# EAGLE design RF1 (EAGLE 6.4)
www.komby.com/RF1
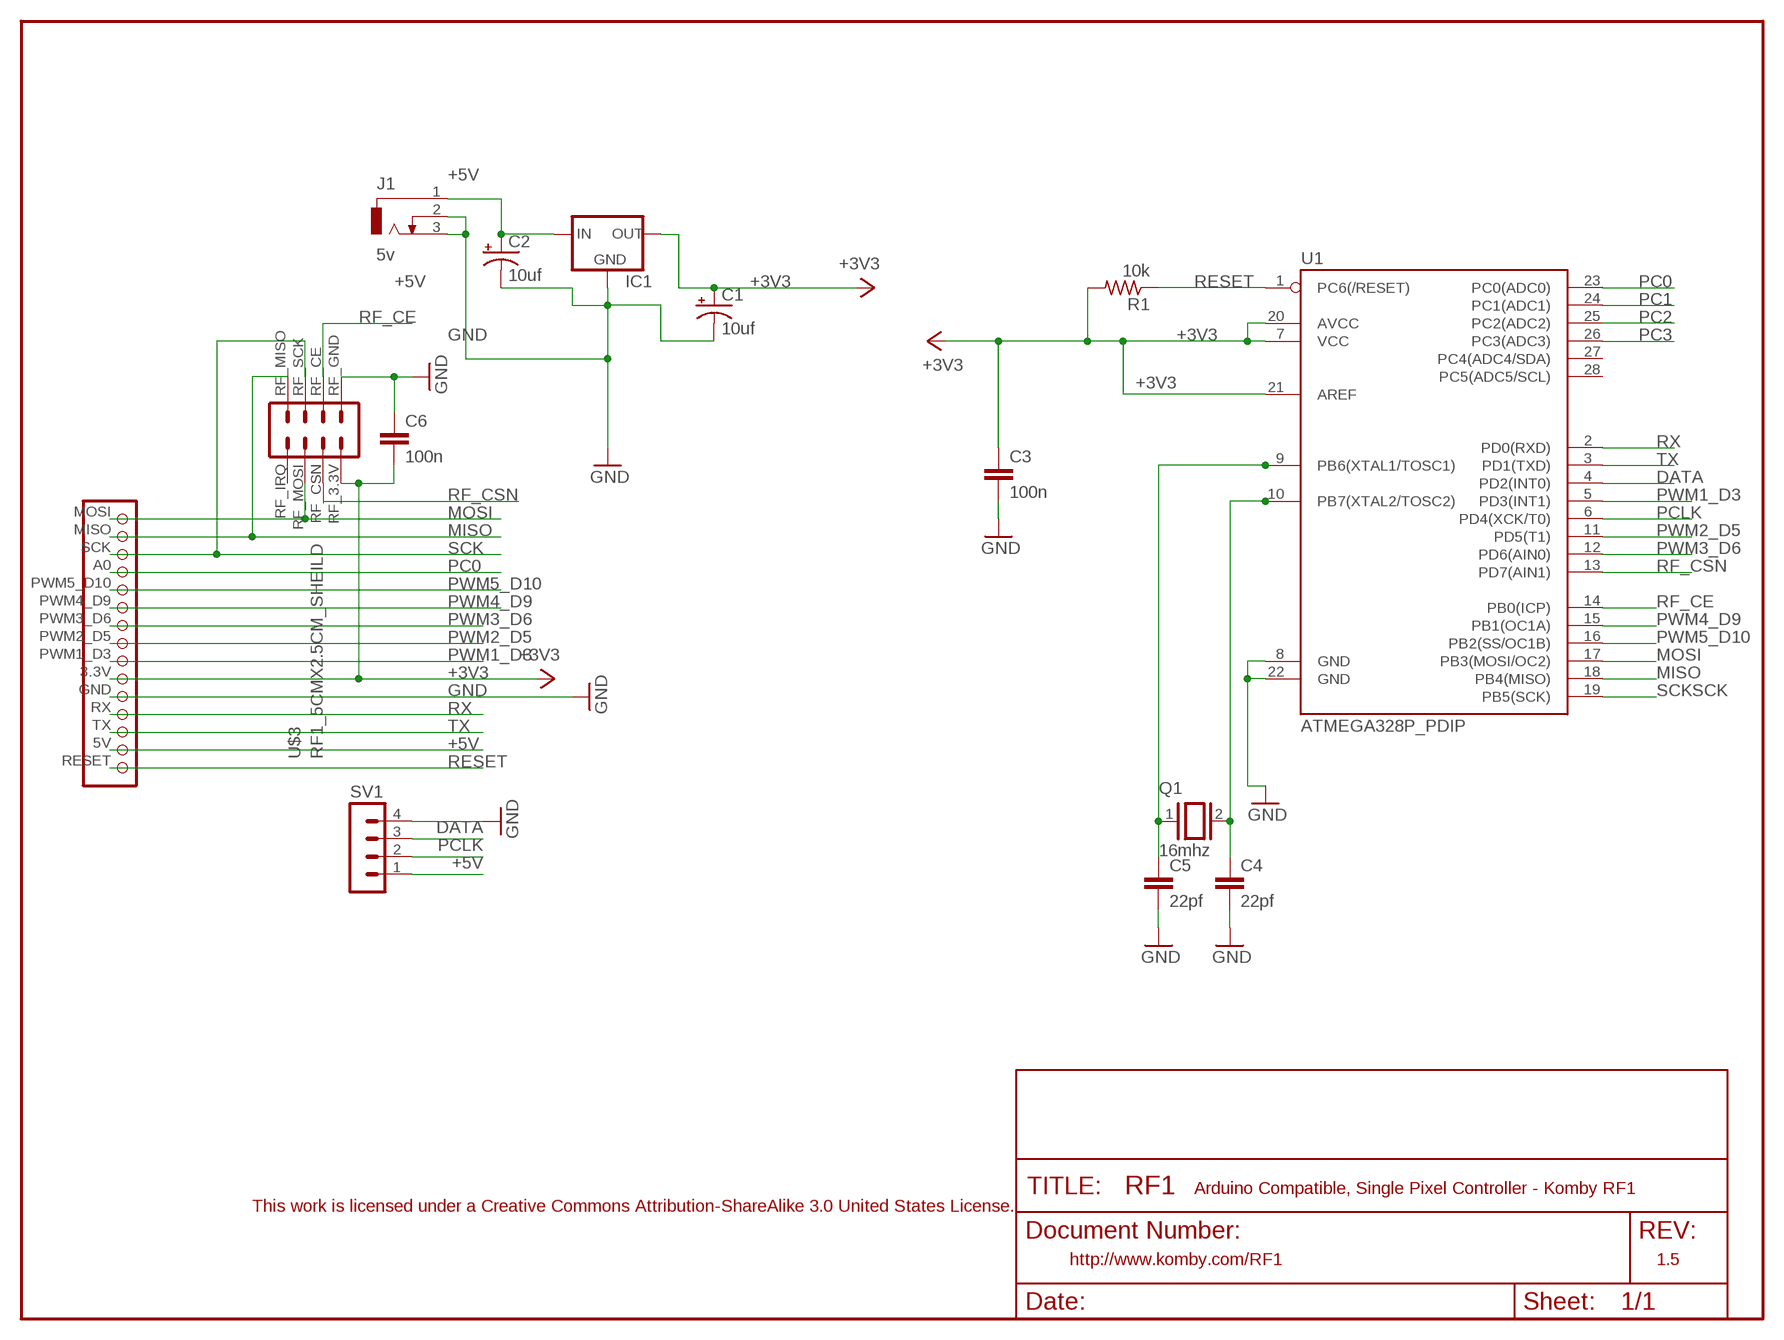
[diagram p0: schematic, sheet 1]

## Parts
C1  10uf  CPOL-USE1.8-4  [E1,8-4]
C2  10uf  CPOL-USE1.8-4  [E1,8-4]
C3  100n  C-EU025-024X044  [C025-024X044]
C4  22pf  C-EU025-024X044  [C025-024X044]
C5  22pf  C-EU025-024X044  [C025-024X044]
C6  100n  C-EU025-024X044  [C025-024X044]
IC1  MCP1700TRI  [TO92]
J1  5v  DCJ0303  [DCJ0303]
Q1  16mhz  XTAL/S  [QS]
R1  10k  R-US_0207/7  [0207/7]
SV1  MA04-1  [MA04-1]
U1  ATMEGA328P_PDIP  [DIL28-3]
U$3  RF1_5CMX2.5CM_SHEILD  [KOMBY_RF1_SHEILD_5X2.5]

## Nets
+3V3 [vcc]: C1.+ C3.1 C6.2 IC1.3(OUT) R1.2 U1.7(VCC) U1.20(AVCC) U1.21(AREF) U$3.3.3V U$3.RF_3.3V
+5V: C2.+ IC1.2(IN) J1.1 SV1.1 U$3.5V
DATA: SV1.3 U1.4(PD2(INT0))
GND [vcc]: C1.- C2.- C3.2 C4.2 C5.2 C6.1 IC1.1(GND) J1.2 J1.3 SV1.4 U1.8(GND) U1.22(GND) U$3.GND U$3.RF_GND(RFGND_1)
MISO: U1.18(PB4(MISO)) U$3.MISO U$3.RF_MISO
MOSI: U1.17(PB3(MOSI/OC2)) U$3.MOSI U$3.RF_MOSI
N$5: C4.1 Q1.2 U1.10(PB7(XTAL2/TOSC2))
N$6: C5.1 Q1.1 U1.9(PB6(XTAL1/TOSC1))
PC0: U1.23(PC0(ADC0)) U$3.A0(PC0)
PC1: U1.24(PC1(ADC1))
PC2: U1.25(PC2(ADC2))
PC3: U1.26(PC3(ADC3))
PCLK: SV1.2 U1.6(PD4(XCK/T0))
PWM1_D3: U1.5(PD3(INT1)) U$3.PWM1_D3(PWM1)
PWM2_D5: U1.11(PD5(T1)) U$3.PWM2_D5(PWM2)
PWM3_D6: U1.12(PD6(AIN0)) U$3.PWM3_D6(PWM3)
PWM4_D9: U1.15(PB1(OC1A)) U$3.PWM4_D9(PWM4)
PWM5_D10: U1.16(PB2(SS/OC1B)) U$3.PWM5_D10(PWM5)
RESET: R1.1 U1.1(PC6(/RESET)) U$3.RESET
RF_CE: U1.14(PB0(ICP)) U$3.RF_CE
RF_CSN: U1.13(PD7(AIN1)) U$3.RF_CSN
RX: U1.2(PD0(RXD)) U$3.RX
SCK: U1.19(PB5(SCK)) U$3.RF_SCK U$3.SCK
TX: U1.3(PD1(TXD)) U$3.TX
Unconnected: U1.27(PC4(ADC4/SDA)) U1.28(PC5(ADC5/SCL)) U$3.RF_IRQ

## Notes on the sheet
- Arduino Compatible, Single Pixel Controller - Komby RF1
- This work is licensed under a Creative Commons Attribution-ShareAlike 3.0 United States License.
- http://www.komby.com/RF1 | 1.5

## Library data of the parts
C1 C2 = adafruit:CPOL-US: POLARIZED CAPACITOR, American symbol
C3-C6 = resistor:C-EU: CAPACITOR, European symbol
IC1 = adafruit:MCP1700: VOLTAGE REGULATOR
J1 = con-jack_komby:DCJ0303: DC POWER JACK Source: DCJ0303.pdf; OC_FARNELL: unknown; OC_NEWARK: unknown
Q1 = special:XTAL/S: CRYSTAL
R1 = adafruit:R-US_: RESISTOR, American symbol
SV1 = con-lstb:MA04-1: PIN HEADER; OC_FARNELL: unknown; OC_NEWARK: unknown
U1 = SparkFun-DigitalIC:ATMEGA328P_PDIP: uC used in the Arduino 32kb flash, 1k EEPROM, 2k SRAM This is the through-hole version of this chip.
U$3 = komby1:RF1_5CMX2.5CM_SHEILD

## Net classes
0 default: width 0.203 mm
1 vcc: width 0.305 mm
2 gnd: width 0.254 mm

## Board
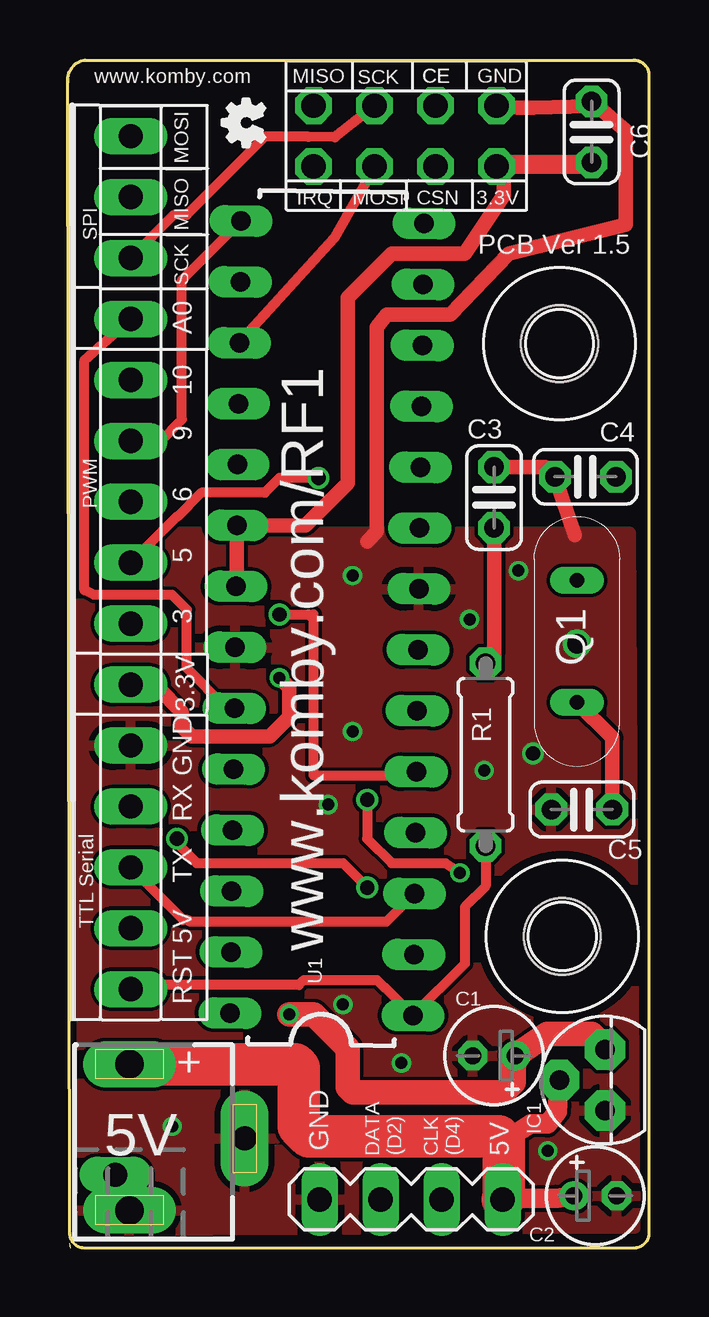
[diagram p1: board, top side]
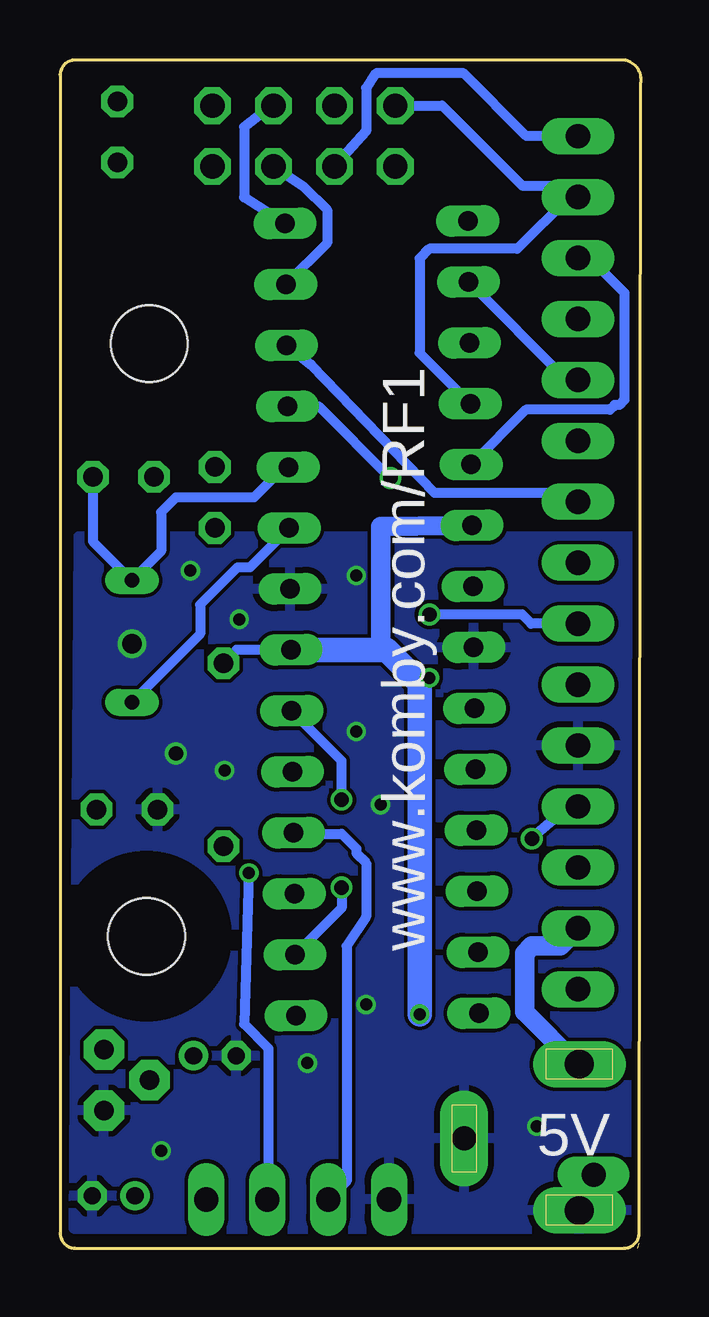
[diagram p2: board, bottom side, seen from below]

Size 24.21 x 49.53 mm. Coordinates in mm from the lower left corner, seen from the top.
Outline: 0.13,0 0.08,0.2
Copper layers (1*16): Top 0.035mm / dielectric 1.5mm / Bottom 0.035mm
Design rules "Fusion_eagle_rule_v1.1": minimum track width 6mil, minimum drill 12mil, track to track 6mil, track to pad 6mil, pad to pad 6mil, via to via 6mil, smd to smd 0mil, copper to edge 10mil, drill to drill 10mil, minimum pad ring 10mil, minimum via ring 6mil, stop-mask expansion 2mil, vias tented up to drill 100mil, thermal gap 10mil

### Footprints (pad centres in the part's own frame; a part is rotated, then mirrored left to right if it is on the bottom)
E1,8-4 = drill 0.711 pad 1.168: + -0.889,0 | drill 0.711 pad 1.168 octagon: - 0.889,0
C025-024X044 = drill 0.813 octagon: 1 -1.27,0; 2 1.27,0
TO92 = drill 0.813 pad 1.676 octagon: 1 -1.27,0; 2 0,1.905; 3 1.27,0
DCJ0303 = drill 1.2 pad 1.93 long: 1 0,3.1; 3 0,-3 | drill 1 pad 2 long: 2 4.8,0 | drill 1 long: P$1 -0.589,-1.501
QS = drill 0.61 long: 1 -2.54,0; 2 2.54,0
0207/7 = drill 0.813 octagon: 1 -3.81,0; 2 3.81,0
MA04-1 = drill 1.016 long: 1 -3.81,0; 2 -1.27,0; 3 1.27,0; 4 3.81,0
DIL28-3 = drill 0.813 long: 1 -16.51,-3.81; 2 -13.97,-3.81; 3 -11.43,-3.81; 4 -8.89,-3.81; 5 -6.35,-3.81; 6 -3.81,-3.81; 7 -1.27,-3.81; 8 1.27,-3.81; 9 3.81,-3.81; 10 6.35,-3.81; 11 8.89,-3.81; 12 11.43,-3.81; 13 13.97,-3.81; 14 16.51,-3.81; 15 16.51,3.81; 16 13.97,3.81; 17 11.43,3.81; 18 8.89,3.81; 19 6.35,3.81; 20 3.81,3.81; 21 1.27,3.81; 22 -1.27,3.81; 23 -3.81,3.81; 24 -6.35,3.81; 25 -8.89,3.81; 26 -11.43,3.81; 27 -13.97,3.81; 28 -16.51,3.81
KOMBY_RF1_SHEILD_5X2.5 = drill 1.016 long: 3.3V 2.54,23.495; 5V 2.54,13.335; A0 2.54,38.735; GND 2.54,20.955; MISO 2.54,43.815; MOSI 2.54,46.355; PWM1_D3 2.54,26.035; PWM2_D5 2.54,28.575; PWM3_D6 2.54,31.115; PWM4_D9 2.54,33.655; PWM5_D10 2.54,36.195; RESET 2.54,10.795; RX 2.54,18.415; SCK 2.54,41.275; TX 2.54,15.875 | drill 1.016 octagon: RF_3.3V 17.78,45.085; RF_CE 15.24,47.625; RF_CSN 15.24,45.085; RF_GND 17.78,47.625; RF_IRQ 10.16,45.085; RF_MISO 10.16,47.625; RF_MOSI 12.7,45.085; RF_SCK 12.7,47.625 | hole 3.2: 20.406,37.703; 20.523,13.005

### Placement (x,y rotation side)
C1  17.76,8.03 180 top
C2  21.98,2.18 0 top
C3  17.76,31.29 90 top
C4  21.57,32.16 180 top
C5  21.42,18.29 180 top
C6  21.83,46.53 270 top
IC1  22.38,7.01 90 top
J1  2.57,4.57 0 top
Q1  21.22,25.3 90 top
R1  17.41,20.57 90 top
SV1  14.31,2.03 180 top
U1  10.8,26.26 89.2 top
U$1  [OSHW_FILLX70_NOTEXT]  8.21,45.92 90 top
U$3  0.08,0 0 top

### Tracks (layer width: path | path; a pad name or v marks a point on that pad's centre or on a via)
+3V3  (via drill 0.5)
  Top 0.61: v8.82,23.77 9.23,23.37 9.23,22.15 8.41,21.34 5.16,21.34 4.76,21.74 4.76,22.35 3.74,23.37 2.75,23.37 U$3.3.3V | C3.1 17.76,24.74 R1.2 | U1.21 7.04,27.62 U1.20 9.89,30.13 11.66,31.9 11.66,39.62 13.49,41.45 16.54,41.45 18.17,43.89 18.17,45.26 C6.2 21.55,45.09 U$3.RF_3.3V
  Top 1.016: IC1.3 22.28,8.48 21.82,8.94 19.97,8.94 C1.+ 18.57,7.54 18.57,6.91 18.17,6.5 11.87,6.5 11.66,6.71 11.66,8.33 10.24,9.75 v9.23,9.75
  Bottom 0.406: U1.7 16.85,24.94 R1.2
  Bottom 0.61: 9.02,21.34 9.23,21.54 | v8.82,23.77 9.02,23.77 9.23,23.57
  Bottom 0.813: U1.20 7.75,30.13 10.85,30.07 10.85,24.94
  Bottom 1.016: U1.7 10.85,24.94 10.6,24.94 9.23,23.57 9.23,21.54 v9.23,9.75
+5V
  Top 0.813: IC1.2 20.4,5.69 20,5.18 19.28,5.18 18.17,4.47 | 18.17,2.08 20.38,2.08 C2.+
  Top 1.778: J1.1 9.48,7.67 9.63,7.52 9.63,5.08 10.04,4.67 17.96,4.67 18.17,4.47 18.17,2.08 SV1.1
  Bottom 0.813: J1.1 2.67,7.67 4.86,9.86 4.86,12.29 4.55,12.6 3.36,12.6 U$3.5V
DATA
  Bottom 0.406: U1.4 14.44,17.27 12.48,17.27 11.87,16.66 11.87,16.46 11.46,16.05 11.46,13.82 12.27,12.6 12.27,2.79 SV1.3 13.09,1.98
GND  (via drill 0.5, 0.6, 0.8 pad 1.02)
  Top 0.61: 21.11,29.72 C4.2 19.89,32.56 C3.2 | 12.48,29.46 12.88,29.87 12.88,38.41 13.29,38.91 15.93,38.91 18.37,41.45 23.25,42.67 23.25,46.58 C6.1 21.77,47.6 19.39,47.55 18.75,47.55 U$3.RF_GND
  other vias: 10.85,18.49 16.75,26.21 13.9,7.72 11.46,10.16 18.78,28.24 19.39,20.62 11.87,21.54 17.35,19.91 4.35,5.08 20,4.06 11.87,28.04 21.22,25.2
  pour Bottom: 23.65,0.81 1.15,0.81 arc-90 0.08,1.27 0.08,29.67 23.45,29.67
  pour Top: 23.65,0.81 1.65,0.71 arc-94 0.29,1.98 0.29,29.87 23.45,29.87
MISO
  Bottom 0.406: U$3.RF_MISO 8.29,47.62 4.96,44.3 3.11,44.3 U$3.MISO 3,43.81 5.16,41.66 8.82,41.66 9.23,41.25 9.23,37.32 U1.18
MOSI
  Top 0.406: U$3.RF_MOSI 11.11,42.11 U1.17
  Bottom 0.406: U$3.MOSI 4.78,46.35 7.4,48.97 11.06,48.97 11.46,48.36 11.46,46.56 U$3.RF_MOSI
N$5
  Bottom 0.406: C4.1 22.84,29.46 Q1.2 20,29.06 20,30.68 19.39,31.29 16.14,31.29 14.87,32.56 U1.10
N$6
  Top 0.61: C5.1 22.69,21.29 Q1.1
  Bottom 0.406: Q1.1 18.37,25.6 18.37,26.82 16.8,28.39 16.29,28.39 U1.9
PC0
  Top 0.406: U1.23 6.63,22.51 4.96,24.18 4.96,26.62 4.35,27.23 1.1,27.23 0.69,27.43 0.69,37.01 U$3.A0
PCLK  (via drill 0.5, 0.6)
  Top 0.406: v12.48,18.69 12.48,17.07 13.49,16.05 15.73,16.05 v16.34,15.65
  Bottom 0.406: v16.34,15.65 16.54,9.35 15.53,8.33 15.53,2.08 SV1.2 | v12.48,18.69 12.48,20.32 U1.6
PWM1_D3  (via drill 0.6)
  Top 0.406: U1.5 14.37,19.71 10.24,19.71 10.24,26.21 | 10.24,26.21 10.24,26.42 | v8.82,26.42 10.04,26.42 10.24,26.21
  Bottom 0.406: U$3.PWM1_D3 4.58,26.04 4.96,26.42 v8.82,26.42
PWM2_D5  (via drill 0.6)
  Top 0.406: v10.45,32.11 8.82,32.11 8.21,31.5 5.57,31.5 4.55,30.48 4.53,30.48 U$3.PWM2_D5
  Bottom 0.406: U1.11 13.44,35.1 v10.45,32.11
PWM3_D6
  Bottom 0.406: U1.12 13.75,36.84 8.62,31.5 3,31.5 U$3.PWM3_D6
PWM4_D9
  Top 0.406: U$3.PWM4_D9 3.87,33.66 4.76,34.54 4.76,40.36 U1.15
PWM5_D10
  Bottom 0.406: U$3.PWM5_D10 3.1,36.2 U1.16
RESET
  Top 0.406: U$3.RESET 2.8,10.97 9.63,10.97 9.84,11.18 12.88,11.18 13.19,10.87 13.21,10.87 U1.1 16.54,11.86 16.54,14.22 17.41,15.09 R1.1
RF_CE
  Bottom 0.406: U$3.RF_CE 15.65,47.42 16.54,46.74 16.54,43.81 U1.14
RF_CSN
  Bottom 0.406: U$3.RF_CSN 14.05,44.25 13.09,43.28 13.09,41.9 U1.13
RX  (via drill 0.6)
  Top 0.406: v4.55,17.07 4.55,16.87 5.37,16.05 11.46,16.05 v12.48,15.04
  Bottom 0.406: U$3.RX 3,18.41 4.35,17.27 v4.55,17.07 | v12.48,15.04 12.48,14.18 U1.2
SCK
  Top 0.406: U$3.RF_SCK 11.13,46.3 10.04,46.33 8.21,46.33 4.96,43.08 4.43,43.08 U$3.SCK
  Bottom 0.406: U$3.SCK 2.14,41.27 0.69,39.83 0.69,35.36 0.9,35.15 1.1,35.15 1.3,34.95 4.8,34.95 U1.19
TX
  Top 0.406: U1.3 13.28,13.61 5.16,13.61 arc-45 4.99,13.69 4.81,13.69 U$3.TX

### Text on the board
tNames: www.komby.com | PCB Ver 1.5 | www.komby.com/RF1 | 5V | GND | DATA / (D2) | CLK / (D4) | 5V
bNames: www.komby.com/RF1 | 5V